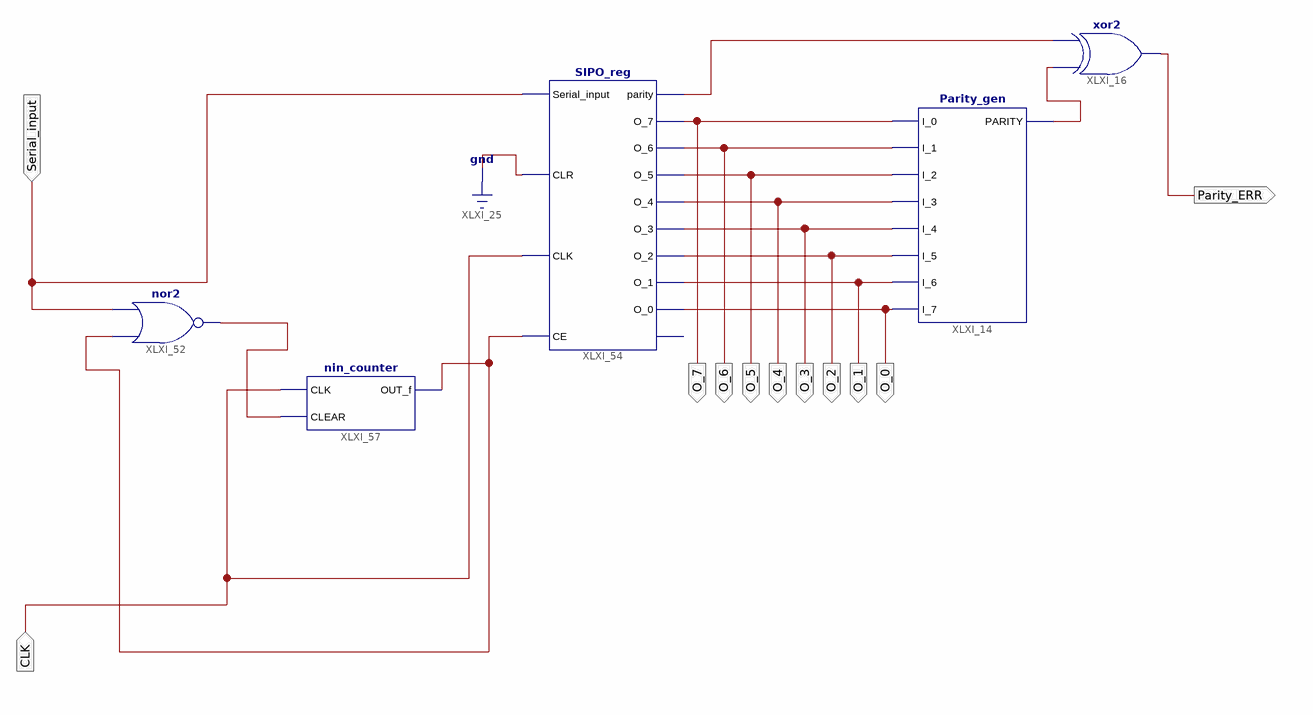
[diagram p0: schematic sheet 1]
// Xilinx ISE schematic usart_receiver.sch (spartan3e) as structural Verilog: 5 symbols, 11 ports
module usart_receiver (
  input  Serial_input,
  input  CLK,
  output O_7,
  output O_6,
  output O_5,
  output O_4,
  output O_3,
  output O_2,
  output O_1,
  output Parity_ERR,
  output O_0
);

  wire dec, par, XLXN_63, XLXN_123;

  xor XLXI_16 (Parity_ERR, XLXN_63, par);
  Parity_gen XLXI_14 (
    .I_0(O_7), .I_1(O_6), .I_2(O_5), .I_3(O_4), .I_4(O_3), .I_5(O_2), .I_6(O_1), .I_7(O_0), .PARITY(XLXN_63));
  nor XLXI_52 (XLXN_123, dec, Serial_input);
  SIPO_reg XLXI_54 (
    .CE(dec), .CLK(CLK), .CLR(1'b0), .Serial_input(Serial_input), .O_0(O_0), .O_1(O_1), .O_2(O_2), .O_3(O_3),
    .O_4(O_4), .O_5(O_5), .O_6(O_6), .O_7(O_7), .parity(par));  // open: start_bit
  nin_counter XLXI_57 (.CLK(CLK), .CLEAR(XLXN_123), .OUT_f(dec));
endmodule
